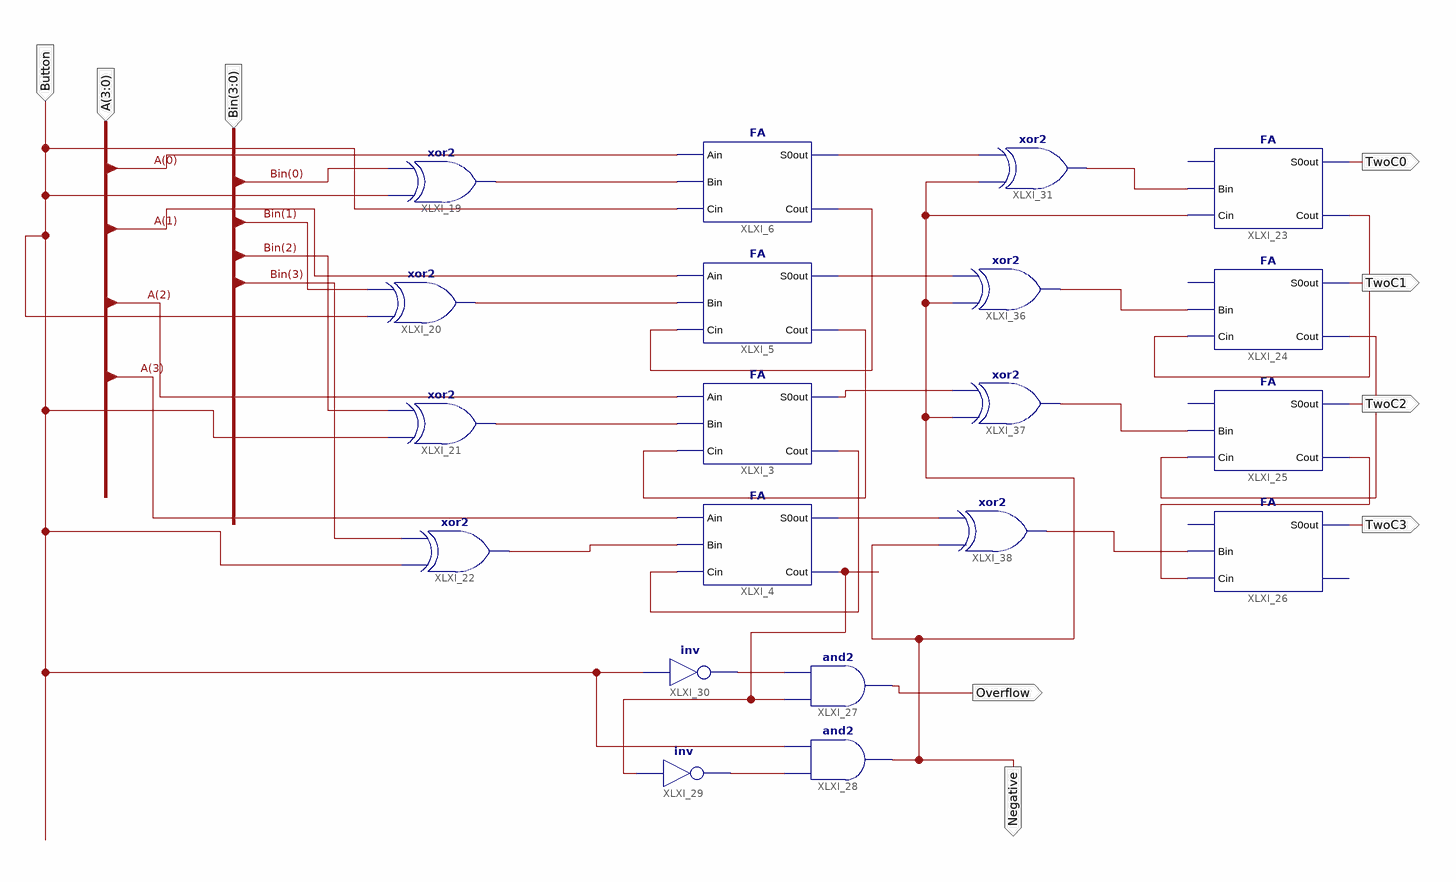
[diagram p0: schematic sheet 1]
// Xilinx ISE schematic Lab5_Exp3.sch (spartan3e) as structural Verilog: 20 symbols, 9 ports
module Lab5_Exp3 (
  input  [3:0] A,
  input  [3:0] Bin,
  input  Button,
  output Negative,
  output Overflow,
  output TwoC0,
  output TwoC1,
  output TwoC2,
  output TwoC3
);

  wire C0out, S0, S1, S2, S3, XLXN_19, XLXN_20, XLXN_21, XLXN_51, XLXN_52, XLXN_53, XLXN_54, XLXN_57,
       XLXN_58, XLXN_80, XLXN_81, XLXN_82, XLXN_83, XLXN_84, XLXN_85, XLXN_86;

  FA XLXI_3 (.Ain(A[2]), .Bin(XLXN_53), .Cin(XLXN_20), .S0out(S2), .Cout(XLXN_21));
  FA XLXI_4 (.Ain(A[3]), .Bin(XLXN_54), .Cin(XLXN_21), .S0out(S3), .Cout(C0out));
  FA XLXI_5 (.Ain(A[1]), .Bin(XLXN_52), .Cin(XLXN_19), .S0out(S1), .Cout(XLXN_20));
  FA XLXI_6 (.Ain(A[0]), .Bin(XLXN_51), .Cin(Button), .S0out(S0), .Cout(XLXN_19));
  xor XLXI_19 (XLXN_51, Button, Bin[0]);
  xor XLXI_20 (XLXN_52, Button, Bin[1]);
  xor XLXI_21 (XLXN_53, Button, Bin[2]);
  xor XLXI_22 (XLXN_54, Button, Bin[3]);
  and XLXI_27 (Overflow, C0out, XLXN_58);
  and XLXI_28 (Negative, XLXN_57, Button);
  not XLXI_29 (XLXN_57, C0out);
  not XLXI_30 (XLXN_58, Button);
  xor XLXI_31 (XLXN_80, Negative, S0);
  xor XLXI_36 (XLXN_81, Negative, S1);
  xor XLXI_37 (XLXN_82, Negative, S2);
  xor XLXI_38 (XLXN_83, Negative, S3);
  FA XLXI_23 (.Bin(XLXN_80), .Cin(Negative), .S0out(TwoC0), .Cout(XLXN_84));  // open: Ain
  FA XLXI_24 (.Bin(XLXN_81), .Cin(XLXN_84), .S0out(TwoC1), .Cout(XLXN_85));  // open: Ain
  FA XLXI_26 (.Bin(XLXN_83), .Cin(XLXN_86), .S0out(TwoC3));  // open: Ain, Cout
  FA XLXI_25 (.Bin(XLXN_82), .Cin(XLXN_85), .S0out(TwoC2), .Cout(XLXN_86));  // open: Ain
endmodule
